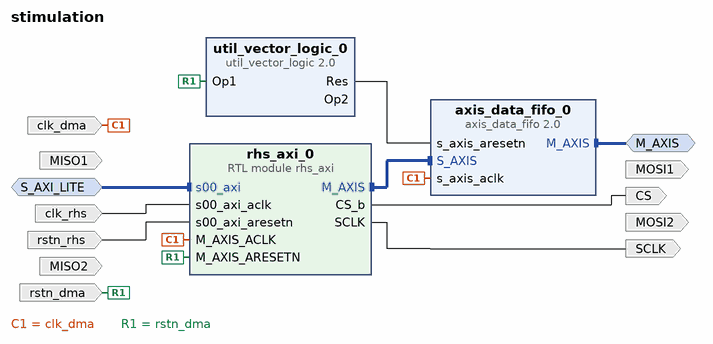
[diagram p0: block diagram of the top level]
# Vivado block design stimulation, xck26-sfvc784-2LV-c, Vivado 2023.1
create_bd_design stimulation

create_bd_intf_port -mode Master -vlnv xilinx.com:interface:axis_rtl:1.0 M_AXIS
create_bd_intf_port -mode Slave -vlnv xilinx.com:interface:aximm_rtl:1.0 S_AXI_LITE
set_property -dict [list \
  CONFIG.ADDR_WIDTH 16 \
  CONFIG.ARUSER_WIDTH 0 \
  CONFIG.AWUSER_WIDTH 0 \
  CONFIG.BUSER_WIDTH 0 \
  CONFIG.DATA_WIDTH 32 \
  CONFIG.HAS_BRESP 1 \
  CONFIG.HAS_BURST 0 \
  CONFIG.HAS_CACHE 0 \
  CONFIG.HAS_LOCK 0 \
  CONFIG.HAS_PROT 1 \
  CONFIG.HAS_QOS 0 \
  CONFIG.HAS_REGION 0 \
  CONFIG.HAS_RRESP 1 \
  CONFIG.HAS_WSTRB 1 \
  CONFIG.ID_WIDTH 0 \
  CONFIG.MAX_BURST_LENGTH 1 \
  CONFIG.NUM_READ_OUTSTANDING 1 \
  CONFIG.NUM_READ_THREADS 1 \
  CONFIG.NUM_WRITE_OUTSTANDING 1 \
  CONFIG.NUM_WRITE_THREADS 1 \
  CONFIG.PROTOCOL AXI4LITE \
  CONFIG.READ_WRITE_MODE READ_WRITE \
  CONFIG.RUSER_BITS_PER_BYTE 0 \
  CONFIG.RUSER_WIDTH 0 \
  CONFIG.SUPPORTS_NARROW_BURST 0 \
  CONFIG.WUSER_BITS_PER_BYTE 0 \
  CONFIG.WUSER_WIDTH 0 \
] [get_bd_intf_ports S_AXI_LITE]
create_bd_port -dir I -type clk clk_dma
set_property -dict {CONFIG.FREQ_HZ 100000000} [get_bd_ports clk_dma]
create_bd_port -dir I MISO1
create_bd_port -dir I MISO2
create_bd_port -dir I -type clk clk_rhs
set_property -dict {CONFIG.FREQ_HZ 100000000} [get_bd_ports clk_rhs]
create_bd_port -dir I -type rst rstn_rhs
create_bd_port -dir I -type rst rstn_dma
create_bd_port -dir O CS
create_bd_port -dir O SCLK
create_bd_port -dir O MOSI1
create_bd_port -dir O MOSI2

create_bd_cell -type ip -vlnv xilinx.com:ip:util_vector_logic:2.0 util_vector_logic_0
set_property -dict {CONFIG.C_SIZE 1} [get_bd_cells util_vector_logic_0]
create_bd_cell -type ip -vlnv xilinx.com:ip:axis_data_fifo:2.0 axis_data_fifo_0
set_property -dict {CONFIG.FIFO_DEPTH 32768 CONFIG.HAS_TLAST 1 CONFIG.TDATA_NUM_BYTES 8} [get_bd_cells axis_data_fifo_0]
create_bd_cell -type module -reference rhs_axi rhs_axi_0

# ---- connections ----

connect_bd_intf_net [get_bd_intf_pins rhs_axi_0/s00_axi] [get_bd_intf_ports S_AXI_LITE]
connect_bd_intf_net [get_bd_intf_pins axis_data_fifo_0/M_AXIS] [get_bd_intf_ports M_AXIS]
connect_bd_intf_net [get_bd_intf_pins rhs_axi_0/M_AXIS] [get_bd_intf_pins axis_data_fifo_0/S_AXIS]
# net MISO1_1 has one end: MISO1
# net MISO2_1 has one end: MISO2
connect_bd_net [get_bd_ports clk_dma] [get_bd_pins axis_data_fifo_0/s_axis_aclk] [get_bd_pins rhs_axi_0/M_AXIS_ACLK]
connect_bd_net [get_bd_ports clk_rhs] [get_bd_pins rhs_axi_0/s00_axi_aclk]
connect_bd_net [get_bd_pins rhs_axi_0/CS_b] [get_bd_ports CS]
# net rhs_axi_0_FIFO_rstn has one end: util_vector_logic_0/Op2
# net rhs_axi_0_MOSI1 has one end: MOSI1
# net rhs_axi_0_MOSI2 has one end: MOSI2
connect_bd_net [get_bd_pins rhs_axi_0/SCLK] [get_bd_ports SCLK]
connect_bd_net [get_bd_ports rstn_dma] [get_bd_pins util_vector_logic_0/Op1] [get_bd_pins rhs_axi_0/M_AXIS_ARESETN]
connect_bd_net [get_bd_ports rstn_rhs] [get_bd_pins rhs_axi_0/s00_axi_aresetn]
connect_bd_net [get_bd_pins util_vector_logic_0/Res] [get_bd_pins axis_data_fifo_0/s_axis_aresetn]

validate_bd_design
save_bd_design
